# Altium schematic sheet schematic.SchDoc
size 350 x 243 mm
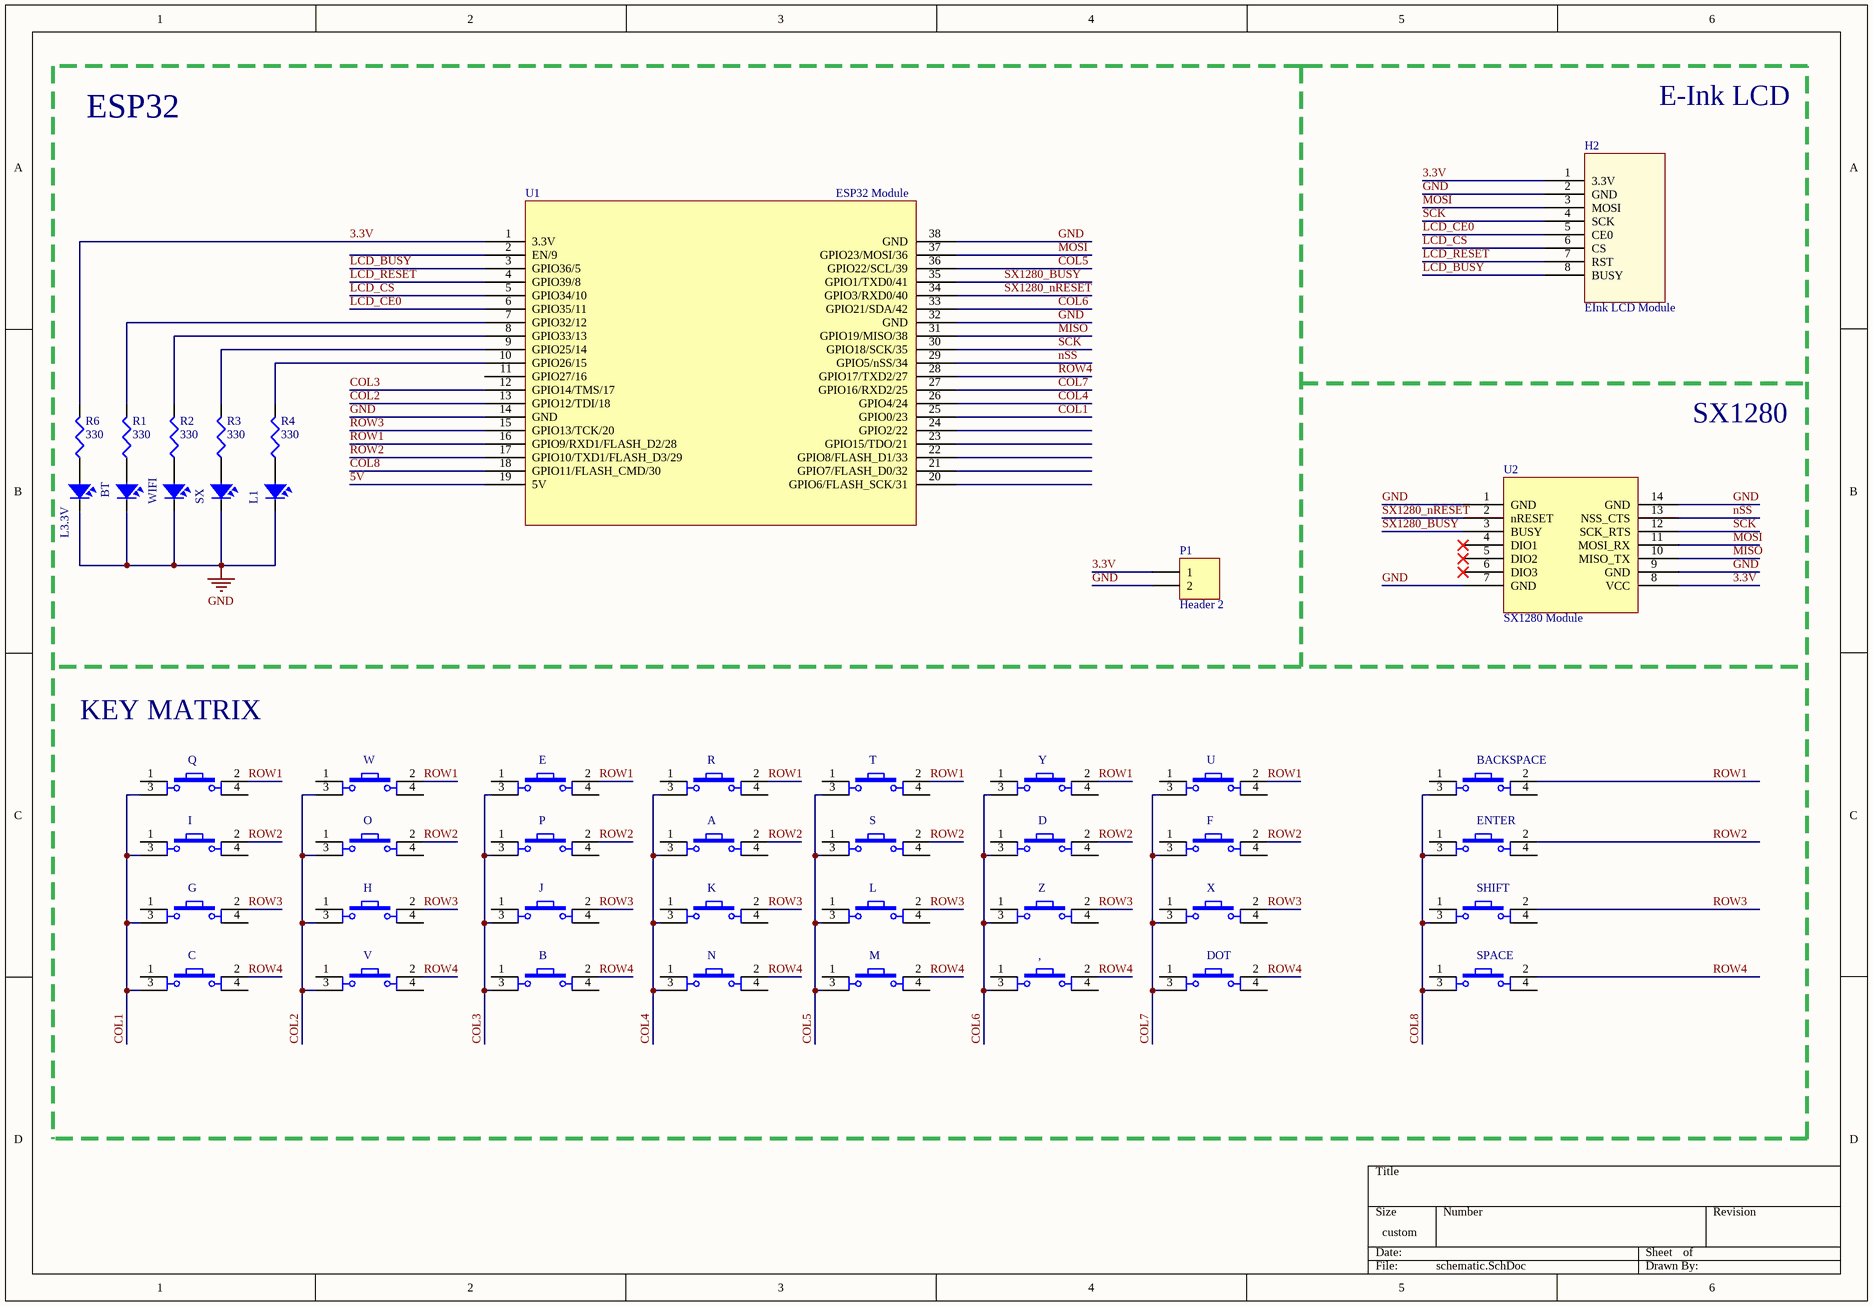
[diagram p0: schematic.SchDoc]

## Parts
,  SW  [Kha_Button]  (value not drawn)
A  SW  [Kha_Button]  (value not drawn)
B  SW  [Kha_Button]  (value not drawn)
BACKSPACE  SW  [Kha_Button]  (value not drawn)
BT  LED SMD  [SM-LED-0805-Blue]  (value not drawn)
C  SW  [Kha_Button]  (value not drawn)
D  SW  [Kha_Button]  (value not drawn)
DOT  SW  [Kha_Button]  (value not drawn)
E  SW  [Kha_Button]  (value not drawn)
ENTER  SW  [Kha_Button]  (value not drawn)
F  SW  [Kha_Button]  (value not drawn)
G  SW  [Kha_Button]  (value not drawn)
H  SW  [Kha_Button]  (value not drawn)
H2  EInk LCD Module  [EInk_Module]
I  SW  [Kha_Button]  (value not drawn)
J  SW  [Kha_Button]  (value not drawn)
K  SW  [Kha_Button]  (value not drawn)
L  SW  [Kha_Button]  (value not drawn)
L1  LED SMD  [SM-LED-0805-Blue]  (value not drawn)
L3.3V  LED SMD  [SM-LED-0805-Blue]  (value not drawn)
M  SW  [Kha_Button]  (value not drawn)
N  SW  [Kha_Button]  (value not drawn)
O  SW  [Kha_Button]  (value not drawn)
P  SW  [Kha_Button]  (value not drawn)
P1  Header 2  [Header 2 SMT]
Q  SW  [Kha_Button]  (value not drawn)
R  SW  [Kha_Button]  (value not drawn)
R1  value 330  [J1-0603]  (hidden comment: Res3)
R2  value 330  [J1-0603]  (hidden comment: Res3)
R3  value 330  [J1-0603]  (hidden comment: Res3)
R4  value 330  [J1-0603]  (hidden comment: Res3)
R6  value 330  [J1-0603]  (hidden comment: Res3)
S  SW  [Kha_Button]  (value not drawn)
SHIFT  SW  [Kha_Button]  (value not drawn)
SPACE  SW  [Kha_Button]  (value not drawn)
SX  LED SMD  [SM-LED-0805-Blue]  (value not drawn)
T  SW  [Kha_Button]  (value not drawn)
U  SW  [Kha_Button]  (value not drawn)
U1  ESP32 Module  [ESP2 Module]
U2  SX1280 Module  [SX1280 Module]
V  SW  [Kha_Button]  (value not drawn)
W  SW  [Kha_Button]  (value not drawn)
WIFI  LED SMD  [SM-LED-0805-Blue]  (value not drawn)
X  SW  [Kha_Button]  (value not drawn)
Y  SW  [Kha_Button]  (value not drawn)
Z  SW  [Kha_Button]  (value not drawn)

## Nets
GND: BT.2 H2.2(GND) L1.2 L3.3V.2 P1.2 SX.2 U1.14(GND) U1.32(GND) U1.38(GND) U2.1(GND) U2.7(GND) U2.9(GND) U2.14(GND) WIFI.2
3.3V: H2.1(3.3V) P1.1 R6.2 U1.1(3.3V) U2.8(VCC)
5V: U1.19(5V)
COL1: C.3 G.3 I.3 Q.3 U1.25(GPIO0/23)
COL2: H.3 O.3 U1.13(GPIO12/TDI/18) V.3 W.3
COL3: B.3 E.3 J.3 P.3 U1.12(GPIO14/TMS/17)
COL4: A.3 K.3 N.3 R.3 U1.26(GPIO4/24)
COL5: L.3 M.3 S.3 T.3 U1.36(GPIO22/SCL/39)
COL6: ,.3 D.3 U1.33(GPIO21/SDA/42) Y.3 Z.3
COL7: DOT.3 F.3 U.3 U1.27(GPIO16/RXD2/25) X.3
COL8: BACKSPACE.3 ENTER.3 SHIFT.3 SPACE.3 U1.18(GPIO11/FLASH_CMD/30)
LCD_BUSY: H2.8(BUSY) U1.3(GPIO36/5)
LCD_CE0: H2.5(CE0) U1.6(GPIO35/11)
LCD_CS: H2.6(CS) U1.5(GPIO34/10)
LCD_RESET: H2.7(RST) U1.4(GPIO39/8)
MISO: U1.31(GPIO19/MISO/38) U2.10(MISO_TX)
MOSI: H2.3(MOSI) U1.37(GPIO23/MOSI/36) U2.11(MOSI_RX)
nSS: U1.29(GPIO5/nSS/34) U2.13(NSS_CTS)
ROW1: BACKSPACE.2 E.2 Q.2 R.2 T.2 U.2 U1.16(GPIO9/RXD1/FLASH_D2/28) W.2 Y.2
ROW2: A.2 D.2 ENTER.2 F.2 I.2 O.2 P.2 S.2 U1.17(GPIO10/TXD1/FLASH_D3/29)
ROW3: G.2 H.2 J.2 K.2 L.2 SHIFT.2 U1.15(GPIO13/TCK/20) X.2 Z.2
ROW4: ,.2 B.2 C.2 DOT.2 M.2 N.2 SPACE.2 U1.28(GPIO17/TXD2/27) V.2
SCK: H2.4(SCK) U1.30(GPIO18/SCK/35) U2.12(SCK_RTS)
SX1280_BUSY: U1.35(GPIO1/TXD0/41) U2.3(BUSY)
SX1280_nRESET: U1.34(GPIO3/RXD0/40) U2.2(nRESET)
NetBT_1: BT.1 R1.1
NetL1_1: L1.1 R4.1
NetL3.3V_1: L3.3V.1 R6.1
NetR1_2: R1.2 U1.7(GPIO32/12)
NetR2_1: R2.1 WIFI.1
NetR2_2: R2.2 U1.8(GPIO33/13)
NetR3_1: R3.1 SX.1
NetR3_2: R3.2 U1.9(GPIO25/14)
NetR4_2: R4.2 U1.10(GPIO26/15)

Not connected (* = marked no-connect by the designer): , 1 4; A 1 4; B 1 4; BACKSPACE 1 4; C 1 4; D 1 4; DOT 1 4; E 1 4; ENTER 1 4; F 1 4; G 1 4; H 1 4; I 1 4; J 1 4; K 1 4; L 1 4; M 1 4; N 1 4; O 1 4; P 1 4; Q 1 4; R 1 4; S 1 4; SHIFT 1 4; SPACE 1 4; T 1 4; U 1 4; U1 2(EN/9) 11(GPIO27/16) 20(GPIO6/FLASH_SCK/31) 21(GPIO7/FLASH_D0/32) 22(GPIO8/FLASH_D1/33) 23(GPIO15/TDO/21) 24(GPIO2/22); U2 4(DIO1)* 5(DIO2)* 6(DIO3)*; V 1 4; W 1 4; X 1 4; Y 1 4; Z 1 4

## Notes on the sheet
- E-Ink LCD
- ESP32
- SX1280
- KEY MATRIX

## Library data of the parts
, A B BACKSPACE C D DOT E ENTER F G H I J K L M N O P Q R S SHIFT SPACE T U V W X Y Z = SW4: Switch button 4 pin; Value: Button chip 4 pin
BT L1 L3.3V SX WIFI = LED-SMD-0805
H2 = E-Ink LCD
P1 = Header 2: Header, 2-Pin; LatestRevisionDate: 17-Jul-2002; LatestRevisionNote: Re-released for DXP Platform.; Publisher: Altium Limited
R1-R4 R6 = Res3: Resistor; Published: 8-Jun-2000; LatestRevisionDate: 29-May-2009; LatestRevisionNote: IPC-7351 Footprint Added.; PackageReference: J1-0603; Publisher: Altium Limited; PackageDescription: Chip Resistor
U1 = ESP32_Module